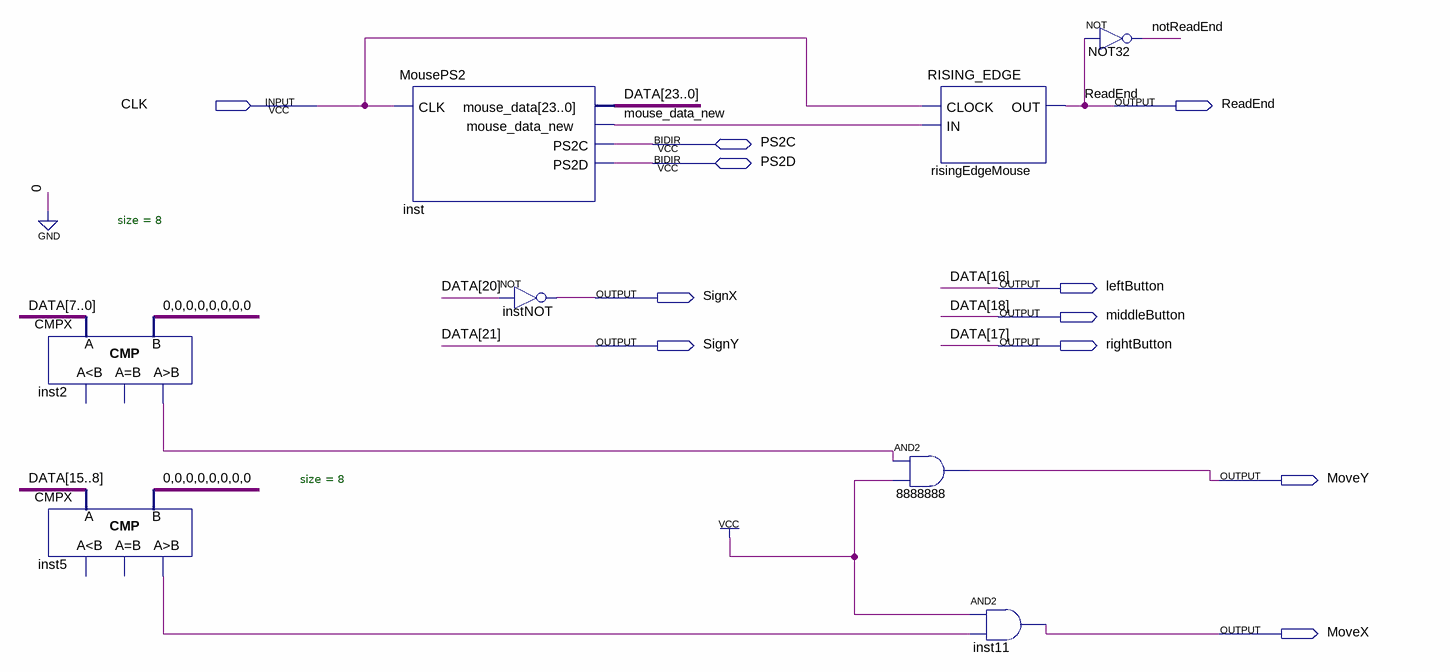
[diagram p0: schematic sheet]
// Quartus schematic MouseInterface.bdf as structural Verilog: 8 symbols, 11 pins
module MouseInterface (
  input  CLK,
  inout  PS2C,
  inout  PS2D,
  output ReadEnd,
  output leftButton,
  output SignX,
  output middleButton,
  output SignY,
  output rightButton,
  output MoveY,
  output MoveX
);

  wire inst2_gr, inst5_gr, mouse_data_new, notReadEnd;
  wire [23:0] DATA;

  CMPX #(.size(8)) inst2 (.A(DATA[7:0]), .B({8{1'b0}}), .gr(inst2_gr));  // open: ls, eq
  CMPX #(.size(8)) inst5 (.A(DATA[15:8]), .B({8{1'b0}}), .gr(inst5_gr));  // open: ls, eq
  MousePS2 inst (
    .CLK(CLK),
    .mouse_data({DATA[23:22], SignY, DATA[20:19], middleButton, rightButton, leftButton, DATA[15:0]}),
    .mouse_data_new(mouse_data_new), .PS2C(PS2C), .PS2D(PS2D));
  not instNOT (SignX, DATA[20]);
  RISING_EDGE risingEdgeMouse (.CLOCK(CLK), .IN(mouse_data_new), .OUT(ReadEnd));
  and u_8888888 (MoveY, inst2_gr, 1'b1);
  and inst11 (MoveX, 1'b1, inst5_gr);
  not NOT32 (notReadEnd, ReadEnd);

  // Other names for the same wires on the sheet: DATA (some bits) = {SignY, middleButton, rightButton, leftButton}
endmodule
